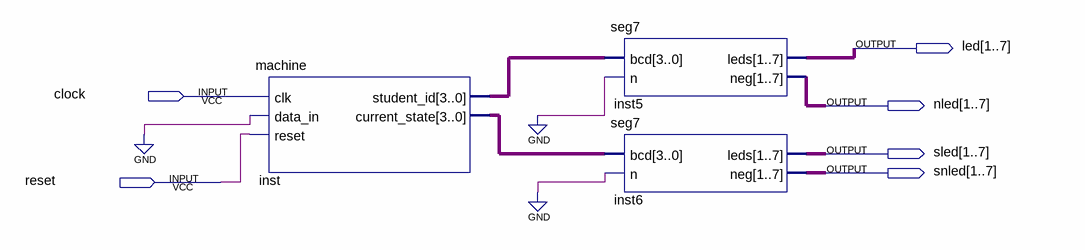
[diagram p0: schematic sheet]
// Quartus schematic lab5.bdf as structural Verilog: 3 symbols, 6 pins
module lab5 (
  input  clock,
  input  reset,
  output [1:7] led,
  output [1:7] nled,
  output [1:7] sled,
  output [1:7] snled
);

  wire [3:0] inst_current_state, inst_student_id;

  machine inst (
    .clk(clock), .data_in(1'b0), .reset(reset), .student_id(inst_student_id),
    .current_state(inst_current_state));
  seg7 inst5 (.bcd(inst_student_id), .n(1'b0), .leds(led), .neg(nled));
  seg7 inst6 (.bcd(inst_current_state), .n(1'b0), .leds(sled), .neg(snled));
endmodule
